# Altium project ControlBoard.PrjPCB
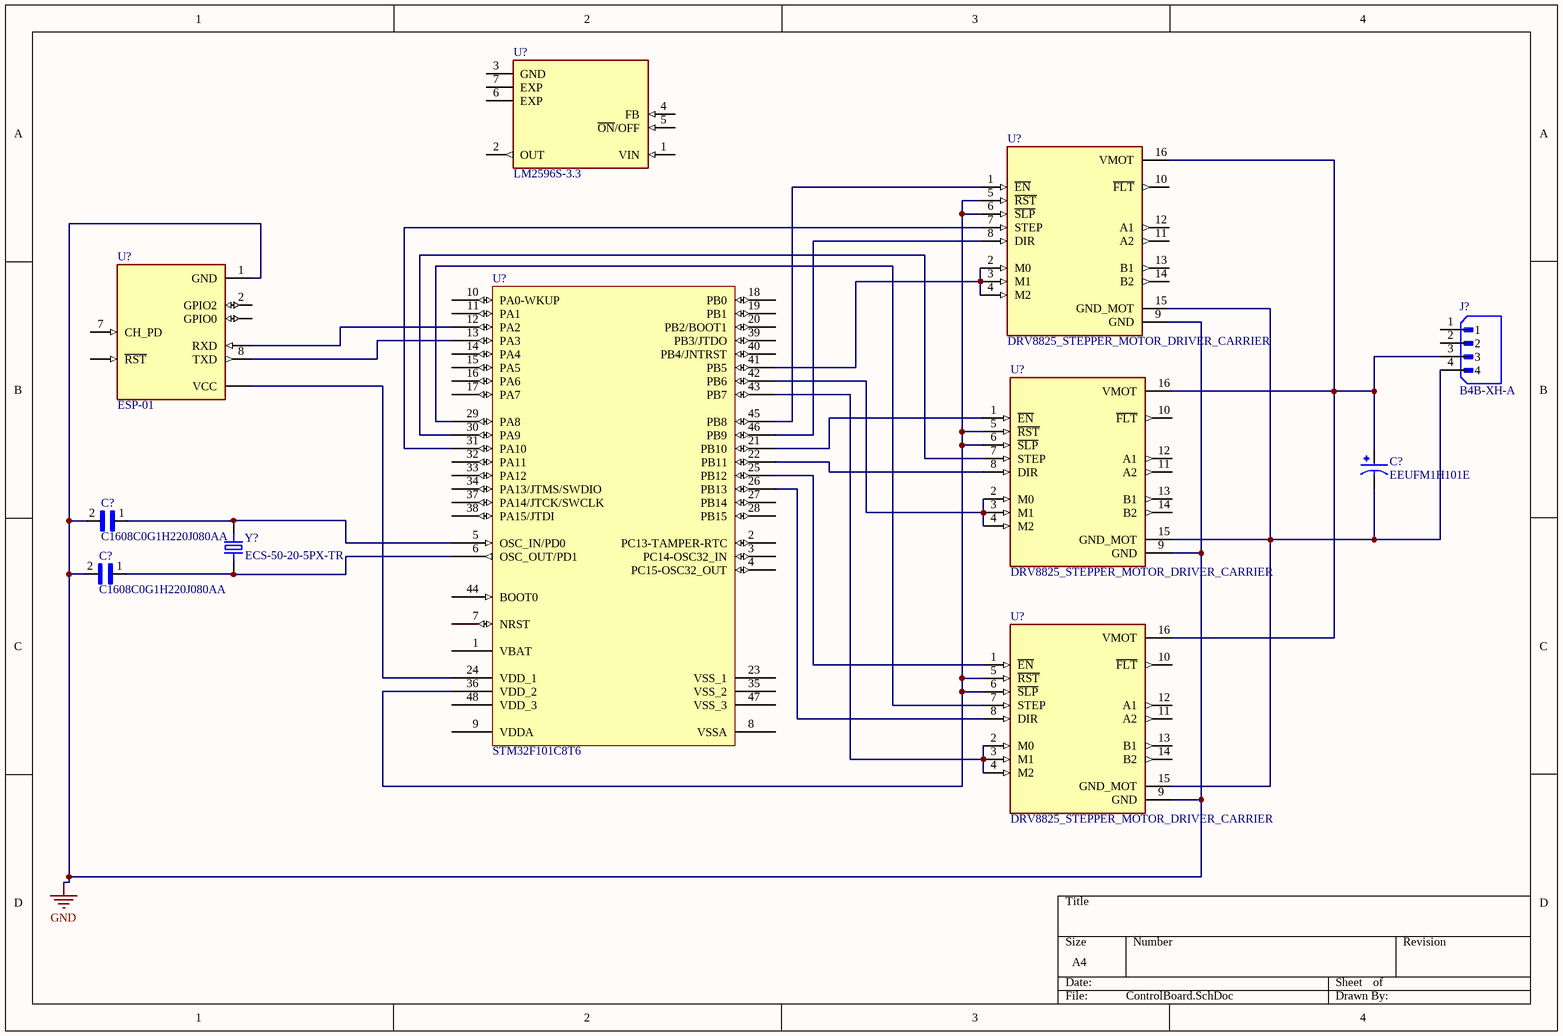
[diagram p0: ControlBoard.SchDoc]
1 sheet, 11 parts. Net scope: global (net labels, ports and power ports of the same name join across sheets).

## Sheet ControlBoard.SchDoc
size A4

### Parts
(Parts that share a designator on the sheet are numbered #1, #2 ... from top to bottom, then left to right.)
C?#1  EEUFM1H101E  [CAPPRD500W60D800H1150]
C?#2  C1608C0G1H220J080AA  [CAPC1608X90N]
C?#3  C1608C0G1H220J080AA  [CAPC1608X90N]
J?  B4B-XH-A  [JST_B4B-XH-A]
U?#1  LM2596S-3.3  [VREG_LM2596S-3.3]
U?#2  DRV8825_STEPPER_MOTOR_DRIVER_CARRIER  [IC_DRV8825_STEPPER_MOTOR_DRIVER_CARRIER]
U?#3  STM32F101C8T6  [LQFP48_N]
U?#4  ESP-01  [MODULE_ESP-01]
U?#5  DRV8825_STEPPER_MOTOR_DRIVER_CARRIER  [IC_DRV8825_STEPPER_MOTOR_DRIVER_CARRIER]
U?#6  DRV8825_STEPPER_MOTOR_DRIVER_CARRIER  [IC_DRV8825_STEPPER_MOTOR_DRIVER_CARRIER]
Y?  ECS-50-20-5PX-TR  [XTAL_ECS-50-20-5PX-TR]

### Nets
GND: C?#2.2 C?#3.2 U?#2.9(GND) U?#4.1(GND) U?#5.9(GND) U?#6.9(GND)
NetC?#1_N: C?#1.N J?.4 U?#2.15(GND_MOT) U?#5.15(GND_MOT) U?#6.15(GND_MOT)
NetC?#1_P: C?#1.P J?.3 U?#2.16(VMOT) U?#5.16(VMOT) U?#6.16(VMOT)
NetC?#2_1: C?#2.1 U?#3.5(OSC_IN/PD0) Y?.2
NetC?#3_1: C?#3.1 U?#3.6(OSC_OUT/PD1) Y?.1
NetU?#2_1: U?#2.1(~{EN}) U?#3.45(PB8)
NetU?#2_2: U?#2.2(M0) U?#2.3(M1) U?#2.4(M2) U?#3.41(PB5)
NetU?#2_5: U?#2.5(~{RST}) U?#2.6(~{SLP}) U?#3.36(VDD_2) U?#5.5(~{RST}) U?#5.6(~{SLP}) U?#6.5(~{RST}) U?#6.6(~{SLP})
NetU?#2_7: U?#2.7(STEP) U?#3.31(PA10)
NetU?#2_8: U?#2.8(DIR) U?#3.46(PB9)
NetU?#3_12: U?#3.12(PA2) U?#4.4(RXD)
NetU?#3_13: U?#3.13(PA3) U?#4.8(TXD)
NetU?#3_21: U?#3.21(PB10) U?#5.1(~{EN})
NetU?#3_22: U?#3.22(PB11) U?#5.8(DIR)
NetU?#3_24: U?#3.24(VDD_1) U?#4.5(VCC)
NetU?#3_25: U?#3.25(PB12) U?#6.1(~{EN})
NetU?#3_26: U?#3.26(PB13) U?#6.8(DIR)
NetU?#3_29: U?#3.29(PA8) U?#6.7(STEP)
NetU?#3_30: U?#3.30(PA9) U?#5.7(STEP)
NetU?#3_42: U?#3.42(PB6) U?#5.2(M0) U?#5.3(M1) U?#5.4(M2)
NetU?#3_43: U?#3.43(PB7) U?#6.2(M0) U?#6.3(M1) U?#6.4(M2)

Not connected (* = marked no-connect by the designer): J? 1 2; U?#1 1(VIN) 2(OUT) 3(GND) 4(FB) 5(~{ON}/OFF) 6(EXP) 7(EXP); U?#2 10(~{FLT}) 11(A2) 12(A1) 13(B1) 14(B2); U?#3 1(VBAT) 2(PC13-TAMPER-RTC) 3(PC14-OSC32_IN) 4(PC15-OSC32_OUT) 7(NRST) 8(VSSA) 9(VDDA) 10(PA0-WKUP) 11(PA1) 14(PA4) 15(PA5) 16(PA6) 17(PA7) 18(PB0) 19(PB1) 20(PB2/BOOT1) 23(VSS_1) 27(PB14) 28(PB15) 32(PA11) 33(PA12) 34(PA13/JTMS/SWDIO) 35(VSS_2) 37(PA14/JTCK/SWCLK) 38(PA15/JTDI) 39(PB3/JTDO) 40(PB4/JNTRST) 44(BOOT0) 47(VSS_3) 48(VDD_3); U?#4 2(GPIO2) 3(GPIO0) 6(~{RST}) 7(CH_PD); U?#5 10(~{FLT}) 11(A2) 12(A1) 13(B1) 14(B2); U?#6 10(~{FLT}) 11(A2) 12(A1) 13(B1) 14(B2)

### Library data of the parts
C?#1 = EEUFM1H101E: Aluminum Electrolytic Capacitors, FM-A Series, 100uF +/- 20%, 50V, Radial lead type(8x11.5mm); MF: Panasonic; SnapEDA_Link: https://www.snapeda.com/parts/EEUFM1H101E/Panasonic/view-part/?ref=snap; Package: RADIAL-2 Panasonic; Value: *; MP: EEUFM1H101E; Check_prices: https://www.snapeda.com/parts/EEUFM1H101E/Panasonic/view-part/?ref=eda
C?#2 C?#3 = C1608C0G1H220J080AA: 22pF Â±5% 50V Ceramic Capacitor C0G, NP0 0603 (1608 Metric); MF: TDK; Value: *; Price: None; Package: 1608 TDK; Availability: In Stock; Check_prices: https://www.snapeda.com/parts/C1608C0G1H220J080AA/TDK/view-part/?ref=eda; Purchase-URL: https://pricing.snapeda.com/search/part/C1608C0G1H220J080AA/?ref=eda; MP: C1608C0G1H220J080AA; SnapEDA_Link: https://www.snapeda.com/parts/C1608C0G1H220J080AA/TDK/view-part/?ref=snap
J? = B4B-XH-A: Connector Header Through Hole 4 position 0.098 (2.50mm); MF: JST Sales; SnapEDA_Link: https://www.snapeda.com/parts/B4B-XH-A/JST/view-part/?ref=snap; Package: None; Value: *; MP: B4B-XH-A; Check_prices: https://www.snapeda.com/parts/B4B-XH-A/JST/view-part/?ref=eda
U?#1 = LM2596S-3.3: SIMPLE SWITCHERÂ® 4.5V to 40V, 3A Low Component Count Step-Down Regulator 5-DDPAK/TO-263; MF: Texas Instruments; SnapEDA_Link: https://www.snapeda.com/parts/LM2596S-3.3/Texas+Instruments/view-part/?ref=snap; Package: TO-263-5 Texas Instruments; Value: *; MP: LM2596S-3.3; Check_prices: https://www.snapeda.com/parts/LM2596S-3.3/Texas+Instruments/view-part/?ref=eda
U?#2 U?#5 U?#6 = DRV8825_STEPPER_MOTOR_DRIVER_CARRIER: Stepper motor controler; IC: DRV8825; 1.5A; Uin mot: 8.2Ã·45V; Availability: Unavailable; MP: DRV8825_STEPPER_MOTOR_DRIVER_CARRIER; Value: *; Price: None; Package: None
U?#3 = STM32F101C8T6: STM32 ARM-based 32-bit MCU with 64 Kbytes Flash, 48-pin LQFP, Industrial Temperature; Published: 30-May-2008; DatasheetVersion: rev6, Mar-2008; PackageVersion: Mar-2008; PackageReference: LQFP48; Publisher: Altium Limited; PackageDescription: 48-Pin Low-Profile Quad Flat Pack, 7 x 7 mm Body, 0.5 mm Pitch (LQFP48); ComponentLink1Description: Manufacturer Link; ComponentLink1URL: www.st.com/stm32; ComponentLink2Description: Datasheet; ComponentLink2URL: http://www.st.com/stonline/products/literature/ds/13586.pdf
U?#4 = ESP-01: ESP-01M ESP8266 DIP Adapter series Transceiver; 802.11 b/g/n (Wi-Fi, WiFi, WLAN) Evaluation Board; MF: AI-Thinker; SnapEDA_Link: https://www.snapeda.com/parts/ESP-01/AI-Thinker/view-part/?ref=snap; Package: Non-Standard AI-Thinker; Value: *; MP: ESP-01; Check_prices: https://www.snapeda.com/parts/ESP-01/AI-Thinker/view-part/?ref=eda
Y? = ECS-50-20-5PX-TR: 5 MHz Â±30ppm Crystal 20pF 80 Ohms HC-49/US; MF: ECS Inc.; SnapEDA_Link: https://www.snapeda.com/parts/ECS-50-20-5PX-TR/ECS/view-part/?ref=snap; Package: CSM-7X-3L-5G3X-2 ECS; Value: *; MP: ECS-50-20-5PX-TR; Check_prices: https://www.snapeda.com/parts/ECS-50-20-5PX-TR/ECS/view-part/?ref=eda